# Altium project AMC_FMC_Carrier v3.PrjPcb (part 13 of 15)

## Sheet Clock_WR.SchDoc
size A3; DocumentNumber: 24; SheetNumber: 24; SheetTotal: 30
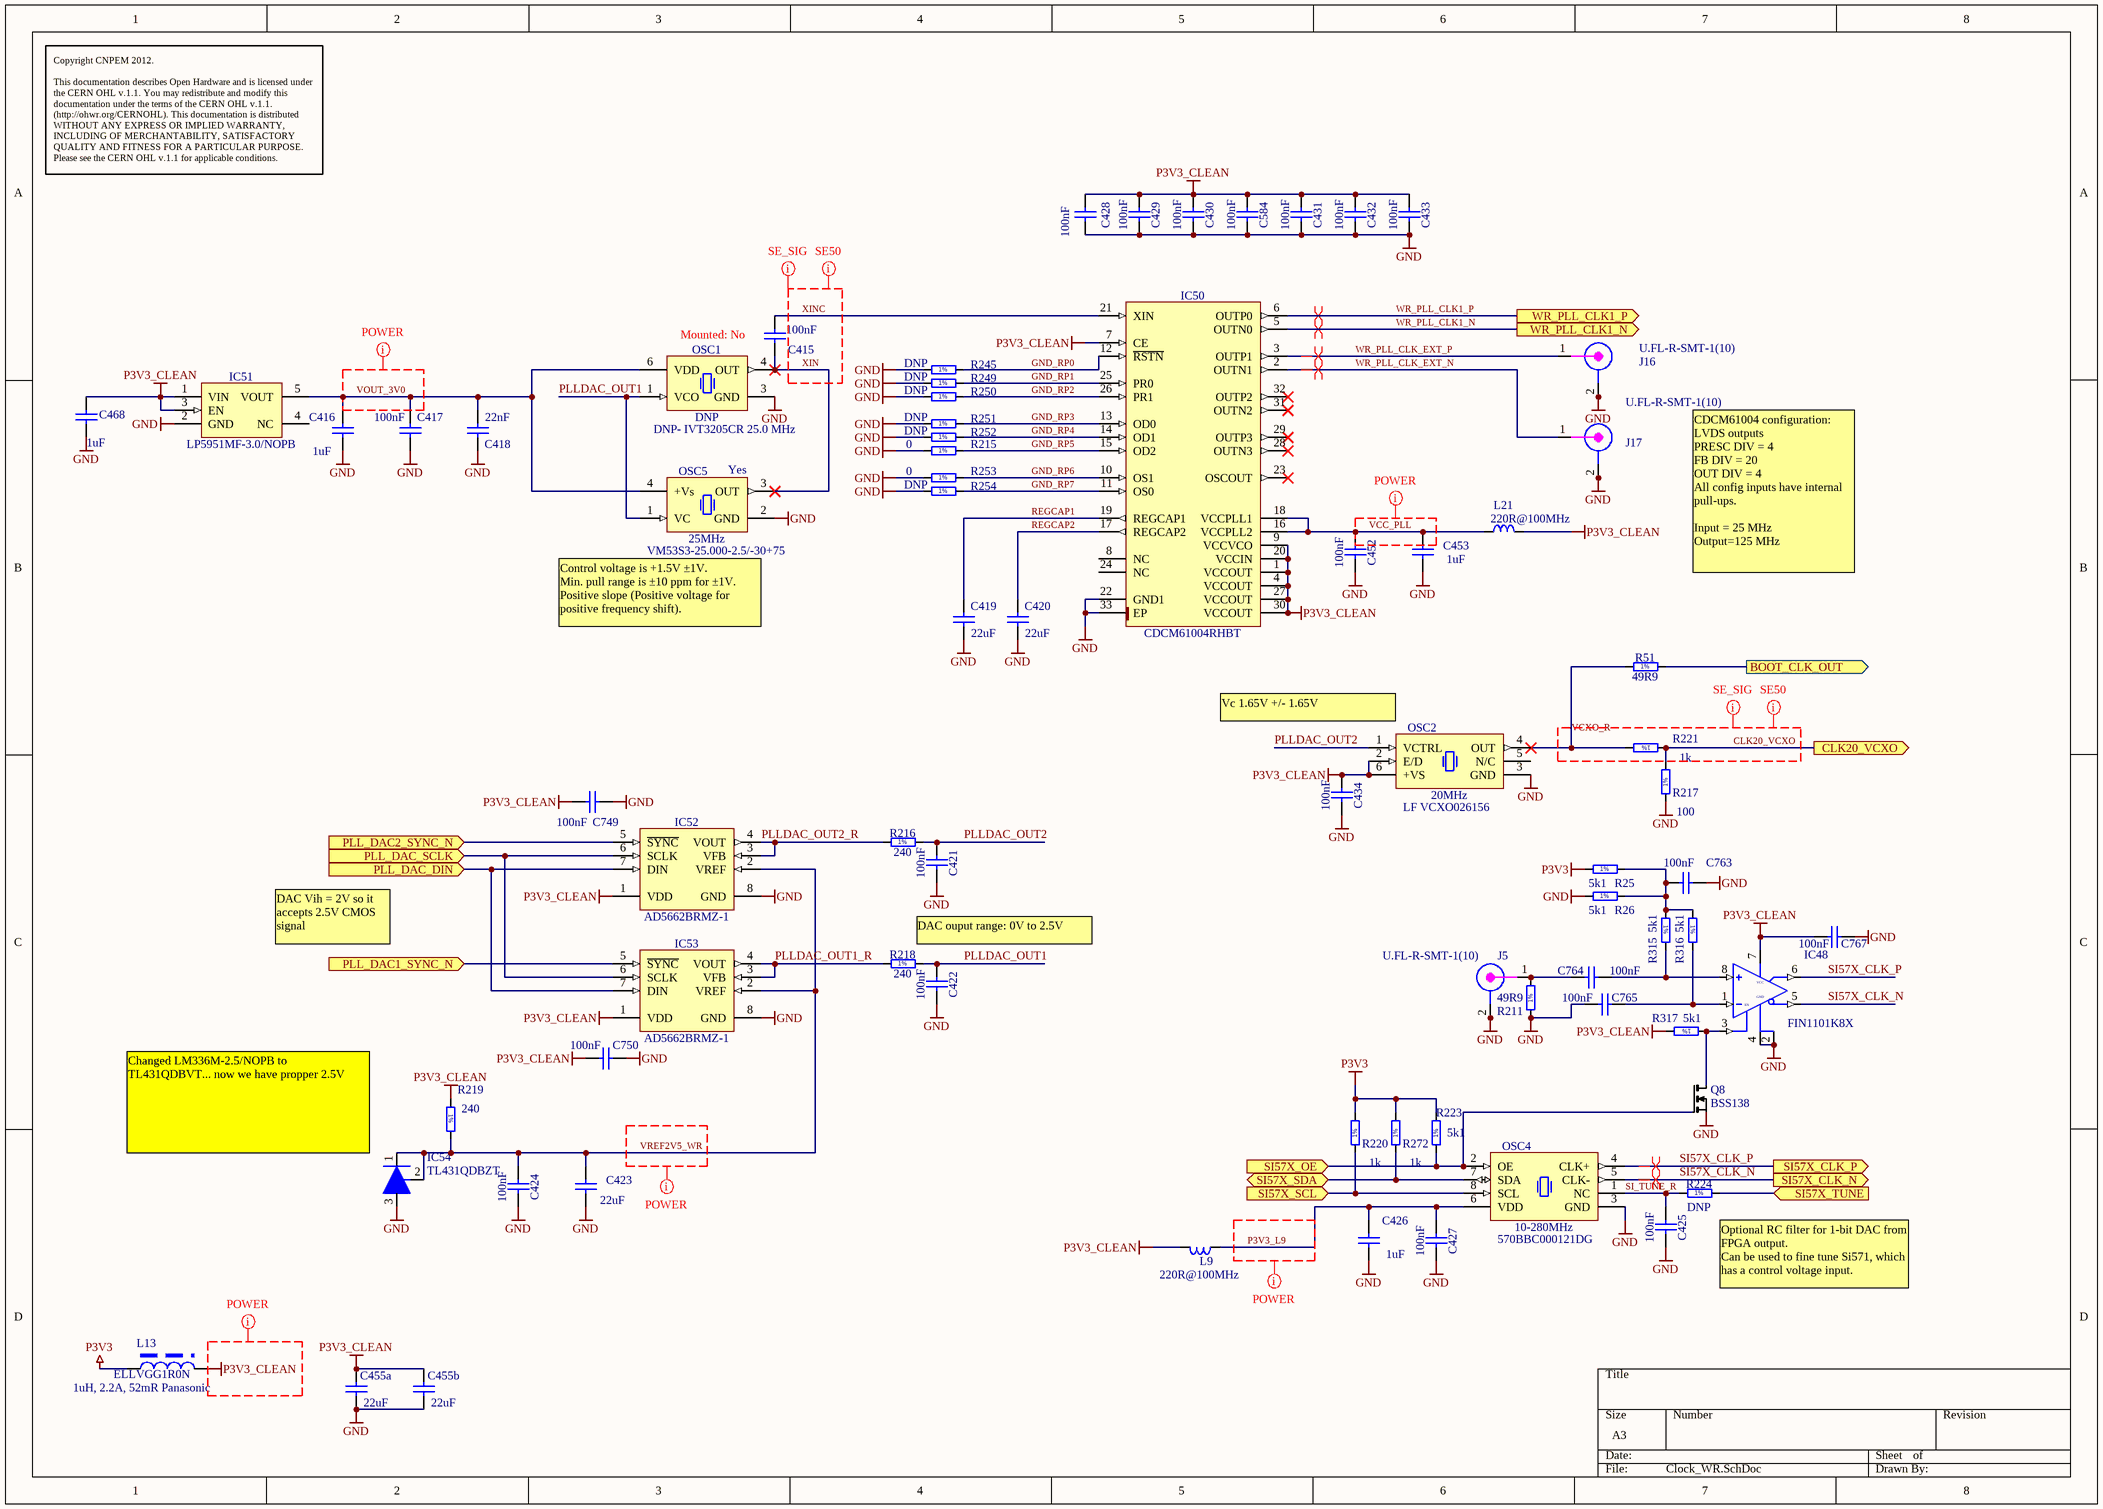
[diagram p29: Clock_WR.SchDoc]

### Parts
C415  100nF  [CAPC0603X33N]
C416  1uF  [CAPC1608X87N]
C417  100nF  [CAPC0603X33N]
C418  22nF  [CAPC0603X33N]
C419  22uF  [CAPC3216X180N]
C420  22uF  [CAPC3216X180N]
C421  100nF  [CAPC0603X33N]
C422  100nF  [CAPC0603X33N]
C423  22uF  [CAPC3216X180N]
C424  100nF  [CAPC0603X33N]
C425  100nF  [CAPC0603X33N]
C426  1uF  [CAPC1608X87N]
C427  100nF  [CAPC0603X33N]
C428  100nF  [CAPC0603X33N]
C429  100nF  [CAPC0603X33N]
C430  100nF  [CAPC0603X33N]
C431  100nF  [CAPC0603X33N]
C432  100nF  [CAPC0603X33N]
C433  100nF  [CAPC0603X33N]
C434  100nF  [CAPC0603X33N]
C452  100nF  [CAPC0603X33N]
C453  1uF  [CAPC1608X87N]
C455a  22uF  [CAPC3216X180N]
C455b  22uF  [CAPC3216X180N]
C468  1uF  [CAPC1608X87N]
C584  100nF  [CAPC0603X33N]
C749  100nF  [CAPC0603X33N]
C750  100nF  [CAPC0603X33N]
C763  100nF  [CAPC0603X33N]
C764  100nF  [CAPC0603X33N]
C765  100nF  [CAPC0603X33N]
C767  100nF  [CAPC0603X33N]
IC48  FIN1101K8X  [US8]
IC50  CDCM61004RHBT  [QFN50P500X500X100-33N-S355]
IC51  LP5951MF-3.0/NOPB  [SOT95P284X122-5N]
IC52  AD5662BRMZ-1  [SOP65P490X110-8N]
IC53  AD5662BRMZ-1  [SOP65P490X110-8N]
IC54  TL431QDBZT  [SOT-23]
J5  U.FL-R-SMT-1(10)  [CON_UFL_HIROSE_RECEPTACLE]
J16  U.FL-R-SMT-1(10)  [CON_UFL_HIROSE_RECEPTACLE]
J17  U.FL-R-SMT-1(10)  [CON_UFL_HIROSE_RECEPTACLE]
L9  220R@100MHz  [INDC2012X105N]
L13  ELLVGG1R0N  [L_ELLVGG2R2N]
L21  220R@100MHz  [INDC2012X105N]
OSC1  DNP  Manufacturer Part Number: DNP- IVT3205CR 25.0 MHz  Mounted: No  [OSC_RAKON_IVT3200C]
OSC2  20MHz  Manufacturer Part Number: LF VCXO026156  [OSC_IQD_CFPV-45]
OSC4  10-280MHz  Manufacturer Part Number: 570BBC000121DG  [OSC_SILICON-LAB_SI570]
OSC5  25MHz  Manufacturer Part Number: VM53S3-25.000-2.5/-30+75  Mounted: Yes  [OSCCC320X500X160-4N]
Q8  BSS138  [SOT95P251X112-3N]
R25  5k1  [RESC1608X55N]
R26  5k1  [RESC1608X55N]
R51  49R9  [RESC1005X40N]
R211  49R9  [RESC1005X40N]
R215  0  [RESC1005X40N]
R216  240  [RESC1005X40N]
R217  100  [RESC1005X40N]
R218  240  [RESC1005X40N]
R219  240  [RESC1005X40N]
R220  1k  [RESC1005X40N]
R221  1k  [RESC1005X40N]
R223  5k1  [RESC1608X55N]
R224  DNP  [RESC1005X40N]
R245  DNP  [RESC1005X40N]
R249  DNP  [RESC1005X40N]
R250  DNP  [RESC1005X40N]
R251  DNP  [RESC1005X40N]
R252  DNP  [RESC1005X40N]
R253  0  [RESC1005X40N]
R254  DNP  [RESC1005X40N]
R272  1k  [RESC1005X40N]
R315  5k1  [RESC1608X55N]
R316  5k1  [RESC1608X55N]
R317  5k1  [RESC1608X55N]

### Ports
BOOT_CLK_OUT (out), CLK20_VCXO (out), PLL_DAC1_SYNC_N (in), PLL_DAC2_SYNC_N (in), PLL_DAC_DIN (in), PLL_DAC_SCLK (in), SI57X_CLK_N (out), SI57X_CLK_P (out), SI57X_OE (in), SI57X_SCL (in), SI57X_SDA (bidir), SI57X_TUNE (in), WR_PLL_CLK1_N (out), WR_PLL_CLK1_P (out)

### Nets
GND: C416.1 C417.2 C418.1 C419.1 C420.1 C421.2 C422.2 C423.1 C424.2 C425.2 C426.1 C427.2 C428.1 C429.2 C430.2 C431.2 C432.2 C433.2 C434.2 C452.2 C453.1 C455a.1 C455b.1 C468.1 C584.2 C749.2 C750.2 C763.2 C765.1 C767.2 IC48.2(GND) IC48.4(GND) IC50.22(GND1) IC50.33(EP) IC51.2(GND) IC52.8(GND) IC53.8(GND) IC54.3(A) J5.2 J5.2a(GND) J16.2 J16.2a(GND) J17.2 J17.2a(GND) OSC1.3(GND) OSC2.3(GND) OSC4.3(GND) OSC5.2(GND) Q8.2(S) R26.1 R211.1 R215.1 R217.1 R245.1 R249.1 R250.1 R251.1 R252.1 R253.1 R254.1
P3V3: L13.1 R25.1 R220.2 R223.2 R272.2
P3V3_CLEAN: C428.2 C429.1 C430.1 C431.1 C432.1 C433.1 C434.1 C455a.2 C455b.2 C468.2 C584.1 C749.1 C750.1 C767.1 IC48.7(VCC) IC50.1(VCCOUT) IC50.4(VCCOUT) IC50.7(CE) IC50.9(VCCVCO) IC50.20(VCCIN) IC50.27(VCCOUT) IC50.30(VCCOUT) IC51.1(VIN) IC51.3(EN) IC52.1(VDD) IC53.1(VDD) L9.2 L13.2 L21.2 OSC2.2(E/D) OSC2.6(+VS) R219.1 R317.2
CLK20_VCXO: R217.2 R221.1 ; port CLK20_VCXO
FPGA_CLK.BOOT_CLK_IN: R51.2 ; port BOOT_CLK_OUT
GND_RP0: IC50.12(~{RSTN}) R245.2
GND_RP1: IC50.25(PR0) R249.2
GND_RP2: IC50.26(PR1) R250.2
GND_RP3: IC50.13(OD0) R251.2
GND_RP4: IC50.14(OD1) R252.2
GND_RP5: IC50.15(OD2) R215.2
GND_RP6: IC50.10(OS1) R253.2
GND_RP7: IC50.11(OS0) R254.2
I2C_Si57.SCL: OSC4.8(SCL) R220.1 ; port SI57X_SCL
I2C_Si57.SDA: OSC4.7(SDA) R272.1 ; port SI57X_SDA
P3V3_L9: C426.2 C427.1 L9.1 OSC4.6(VDD)
PLL_DAC1_SYNC_N: IC53.5(~{SYNC}) ; port PLL_DAC1_SYNC_N
PLL_DAC2_SYNC_N: IC52.5(~{SYNC}) ; port PLL_DAC2_SYNC_N
PLL_DAC_DIN: IC52.7(DIN) IC53.7(DIN) ; port PLL_DAC_DIN
PLL_DAC_SCLK: IC52.6(SCLK) IC53.6(SCLK) ; port PLL_DAC_SCLK
PLLDAC_OUT1: C422.1 OSC1.1(VCO) OSC5.1(VC) R218.2
PLLDAC_OUT1_R: IC53.3(VFB) IC53.4(VOUT) R218.1
PLLDAC_OUT2: C421.1 OSC2.1(VCTRL) R216.2
PLLDAC_OUT2_R: IC52.3(VFB) IC52.4(VOUT) R216.1
REGCAP1: C419.2 IC50.19(REGCAP1)
REGCAP2: C420.2 IC50.17(REGCAP2)
SI57X_CLK_N: IC48.5(~{Q}) OSC4.5(CLK-) ; port SI57X_CLK_N
SI57X_CLK_P: IC48.6(Q) OSC4.4(CLK+) ; port SI57X_CLK_P
SI57X_OE: OSC4.2(OE) Q8.1(G) R223.1 ; port SI57X_OE
SI57X_TUNE: R224.2 ; port SI57X_TUNE
SI_TUNE_R: C425.1 OSC4.1(NC) R224.1
VCC_PLL: C452.1 C453.2 IC50.16(VCCPLL2) IC50.18(VCCPLL1) L21.1
VCXO_R: OSC2.4(OUT) R51.1 R221.2
VOUT_3V0: C416.2 C417.1 C418.2 IC51.5(VOUT) OSC1.6(VDD) OSC5.4(+Vs)
VREF2V5_WR: C423.2 C424.1 IC52.2(VREF) IC53.2(VREF) IC54.1(I/O) IC54.2(REF) R219.2
WR_PLL_CLK1_N: IC50.5(OUTN0) ; port WR_PLL_CLK1_N
WR_PLL_CLK1_P: IC50.6(OUTP0) ; port WR_PLL_CLK1_P
WR_PLL_CLK_EXT_N: IC50.2(OUTN1) J17.1
WR_PLL_CLK_EXT_P: IC50.3(OUTP1) J16.1
XIN: C415.1 OSC1.4(OUT) OSC5.3(OUT)
XINC: C415.2 IC50.21(XIN)
NetC763_1: C763.1 R25.2 R26.2 R315.1 R316.1
NetC764_1: C764.1 IC48.8(IN) R315.2
NetC764_2: C764.2 J5.1 R211.2
NetC765_2: C765.2 IC48.1(IN) R316.2
NetIC48_3: IC48.3(EN) Q8.3(D) R317.1

Not connected (* = marked no-connect by the designer): IC50 8(NC) 23(OSCOUT)* 24(NC) 28(OUTN3)* 29(OUTP3)* 31(OUTN2)* 32(OUTP2)*; IC51 4(NC); OSC2 5(N/C)

### Layout directives
differential pair: SI57X_CLK_N, SI57X_CLK_P, WR_PLL_CLK1_N, WR_PLL_CLK1_P, WR_PLL_CLK_EXT_N, WR_PLL_CLK_EXT_P
net class DE_SIG: CLK20_VCXO, VCXO_R, XIN, XINC
net class SE50: CLK20_VCXO, VCXO_R, XIN, XINC
net class POWER: P3V3_CLEAN, P3V3_L9, VCC_PLL, VOUT_3V0, VREF2V5_WR

### Notes on the sheet
- Copyright CNPEM 2012.
  This documentation describes Open Hardware and is licensed under the CERN OHL v.1.1. You may redistribute and modify this documentation under the terms of the CERN OHL v.1.1. (http://ohwr.org/CERNOHL). This documentation is distributed WITHOUT ANY EXPRESS OR IMPLIED WARRANTY, INCLUDING OF MERCHANTABILITY, SATISFACTORY QUALITY AND FITNESS FOR A PARTICULAR PURPOSE. Please see the CERN OHL v.1.1 for applicable conditions.
- CDCM61004 configuration:
  LVDS outputs
  PRESC DIV = 4
  FB DIV = 20
  OUT DIV = 4
  All config inputs have internal pull-ups.
  Input = 25 MHz
  Output=125 MHz
- (near OSC5) Control voltage is +1.5V ±1V.
  Min. pull range is ±10 ppm for ±1V.
  Positive slope (Positive voltage for positive frequency shift).
- (near OSC2) Vc 1.65V +/- 1.65V
- DAC Vih = 2V so it accepts 2.5V CMOS signal
- DAC ouput range: 0V to 2.5V
- (near IC54) Changed LM336M-2.5/NOPB to TL431QDBVT... now we have propper 2.5V
- (near R224) Optional RC filter for 1-bit DAC from FPGA output.
  Can be used to fine tune Si571, which has a control voltage input.
- (in symbol L_CHOKE_ELLVGG) 1uH, 2.2A, 52mR Panasonic
- (in symbol R0402_0R_JUMPER) 1%
- (in symbol R0402_1K_1%_0.0625W_100PPM) 1%
- (in symbol R0402_49R9_1%_0.0625W_100PPM) 1%
- (in symbol R0402_100R_1%_0.0625W_100PPM) 1%
- (in symbol R0402_240R_1%_0.0625W_100PPM) 1%
- (in symbol R0603_5K1_1%_0.1W_100PPM) 1%

### Library data of the parts
C415 C417 C421 C422 C424 C425 C427-C434 C452 C584 C749 C750 C763-C765 C767 = CC0201_100NF_6.3V_10%_X5R: as C297 on sheet M-LVDS PHY; Part Number: CC0201_100NF_6.3V_10%_X5R; Component Kind: Standard; Component Type: Standard; Pin Count: 2; Value: 100nF; Status: Not Recommended; Manufacturer Part Number: CC0201_100NF_6.3V_10%_X5R; Case: 0201; Mounted: Yes; Socket: No; SMD: Yes; Manufacturer1 Example: AVX; Manufacturer1 ComponentHeight: 0.33mm; HelpURL: \\cern.ch\dfs\Applications\Altium\Datasheets\CC0201_X5R_AVX.pdf; Author: CERN DEM JLC; CreateDate: 2007-12-03; LatestRevisionDate: 2007-12-03
C416 C426 C468 = CC0603_1UF_16V_10%_X7R: Non-polarised capacitor; Part Description: SMD Multilayer Chip Ceramic Capacitor; Manufacturer: GENERIC; Manufacturer1 Part Number: 223824613663; Voltage: 16V; TC: X7R; Tolerance: ±10%; Table: Capacitors SMD; Part Number: CC0603_1UF_16V_10%_X7R; Component Kind: Standard; Component Type: Standard; Pin Count: 2; Value: 1uF; Status: Preferred; Manufacturer Part Number: CC0603_1uF_16V_10%_X7R; Case: 0603; Mounted: Yes; Socket: No; SMD: Yes; Manufacturer1 Example: PHYCOMP; Manufacturer1 ComponentHeight: 0.87mm; HelpURL: \\cern.ch\dfs\Applications\Altium\Datasheets\CC0805_X5R_PHYCOMP_HC.pdf; Author: CERN DEM JLC; CreateDate: 03/12/2007; LatestRevisionDate: 03/12/2007
C418 = CC0201_22NF_6.3V_10%_X5R: Non-polarised capacitor; Part Description: SMD Multilayer Chip Ceramic Capacitor; Manufacturer: GENERIC; Manufacturer1 Part Number: 02016D223KAT2A; Voltage: 6.3V; TC: X5R; Tolerance: ±10%; Table: Capacitors SMD; Part Number: CC0201_22NF_6.3V_10%_X5R; Component Kind: Standard; Component Type: Standard; Pin Count: 2; Value: 22nF; Status: Not Recommended; Manufacturer Part Number: CC0201_22NF_6.3V_10%_X5R; Case: 0201; Mounted: Yes; Socket: No; SMD: Yes; Manufacturer1 Example: AVX; Manufacturer1 ComponentHeight: 0.33mm; HelpURL: \\cern.ch\dfs\Applications\Altium\Datasheets\CC0201_X5R_AVX.pdf; Author: CERN DEM JLC; CreateDate: 2007-12-03; LatestRevisionDate: 2007-12-03
C419 C420 C423 C455a C455b = CC1206_22UF_10V_10%_X7R: as C454 on sheet Clock_management; Part Number: CC1206_22UF_10V_10%_X7R; Component Kind: Standard; Component Type: Standard; Pin Count: 2; Value: 22uF; Status: Preferred; Manufacturer Part Number: CC1206_22UF_10V_10%_X7R; Case: 1206; Mounted: Yes; Socket: No; SMD: Yes; Manufacturer1 Example: MURATA; Manufacturer1 ComponentHeight: 1.8mm; HelpURL: \\cern.ch\dfs\Applications\Altium\Datasheets\CC1206_X7R_MURATA_GRM-HI-CAP.pdf; Author: CERN DEM JLC; CreateDate: 2010-06-08; LatestRevisionDate: 2010-06-08
C453 = CC0603_1UF_16V_10%_X7R: Non-polarised capacitor; Part Description: SMD Multilayer Chip Ceramic Capacitor; Manufacturer: GENERIC; Manufacturer1 Part Number: 223824613663; Manufacturer1 Datasheet: \\cern.ch\dfs\Applications\Altium\Datasheets\CC0805_X5R_PHYCOMP_HC.pdf; Voltage: 16V; TC: X7R; Tolerance: ±10%; Table: Capacitors SMD; Part Number: CC0603_1UF_16V_10%_X7R; Component Kind: Standard; Component Type: Standard; Designator: Capacitor - non polarized; Library Reference: Capacitor - non polarized; Pin Count: 2; Value: 1uF; Status: Preferred; Manufacturer Part Number: CC0603_1uF_16V_10%_X7R; Case: 0603; Mounted: Yes; Socket: No; SMD: Yes; Manufacturer1 Example: PHYCOMP; Manufacturer1 ComponentHeight: 0.87mm; HelpURL: \\cern.ch\dfs\Applications\Altium\Datasheets\CC0805_X5R_PHYCOMP_HC.pdf; Author: CERN DEM JLC; CreateDate: 03/12/2007; LatestRevisionDate: 03/12/2007
IC48 = IFC_FIN1101K8X: LVDS TO LVDS repeater3.3V
IC50 = CDCM61004RHBT: Four Output, Integrated VCO, Low-Jitter Clock Generator; Manufacturer: TEXAS INSTRUMENTS; Table: Analog & Interface; Part Number: CDCM61004RHBT; Component Kind: Standard; Component Type: Standard; Device: CDCM61004RHBT; PackageDescription: QFN, (MO-220-VHHD-4) 0.50mm pitch,square; 8 pin X 8 pin, 5mm X 5mm X 1.00mm H body (w/thermal tab 3.5 X 3.5mm),  IPC Medium Density; Part Description: Four Output, Integrated VCO, Low-Jitter Clock Generator; Manufacturer Part Number: CDCM61004RHBT; Pin Count: 33; Case: QFN32; Mounted: Yes; Socket: No; SMD: Yes; ComponentHeight: 1mm; Author: CERN DEM JLC; HelpURL: \\cern.ch\dfs\Applications\Altium\Datasheets\CDCM61004RHBT.pdf; CreateDate: 2010-08-25; LatestRevisionDate: 2010-08-25
IC51 = LP5951MF-3.0/NOPB: 150mA Micropower Low-Dropout CMOS Voltage Regulator; Part Description: 3V,  150mA Micropower Low-Dropout CMOS Voltage Regulator; Manufacturer: NATIONAL SEMICONDUCTOR; Table: Regulators; Part Number: LP5951MF-3.0/NOPB; Component Kind: Standard; Component Type: Standard; Device: LP5951MF-3.0/NOPB; PackageDescription: SOT23 5, Pitch 0.95mm - Body 1.67x2.99mm, IPC Medium Density; Manufacturer Part Number: LP5951MF-3.0/NOPB; Pin Count: 5; Case: SOT23-5; Mounted: Yes; Socket: No; SMD: Yes; ComponentHeight: 1.19mm; HelpURL: \\cern.ch\dfs\Applications\Altium\Datasheets\LP5951MF-3.0-NOPB.pdf; Author: CERN DEM JLC; CreateDate: 24/01/2011; LatestRevisionDate: 24/01/2011
IC52 IC53 = AD5662BRMZ-1: 2.7V to 5.5V, 250uA, Rail-to-Rail Output 16-Bit nanoDAC; Manufacturer: ANALOG DEVICES; Table: Analog & Interface; Part Number: AD5662BRMZ-1; Component Kind: Standard; Component Type: Standard; Device: AD5662BRMZ-1; PackageDescription: SOP, 8-Leads, Body 3.0x3.0mm, Pitch 0.65mm, IPC Medium Density; Part Description: 2.7V to 5.5V, 250uA, Rail-to-Rail Output 16-Bit nanoDAC; Manufacturer Part Number: AD5662BRMZ-1; Pin Count: 8; Case: MSOP8; Mounted: Yes; Socket: No; SMD: Yes; ComponentHeight: 1.1mm; Author: CERN DEM JLC; HelpURL: \\cern.ch\dfs\Applications\Altium\Datasheets\AD5662BRMZ-1.pdf; CreateDate: 1/10/2011; LatestRevisionDate: 1/10/2011
IC54 = REF_TL431_SOT23: 2.5V ADJ Voltage reference
J5 J16 J17 = CON_UFL_SMD: UFL; Supplier 1: Newark; Supplier Part Number 1: 50P8856
L9 L21 = IND0805_MURATA_BLM21PG221SN1D: Inductor; Part Description: SMD EMIFIL Suppression Chip Bead Ferrite; Manufacturer: MURATA; Power: 2A; Resistance: 0.05R; Tolerance: ±25%; Table: Inductors SMD; Part Number: IND0805_MURATA_BLM21PG221SN1D; Component Kind: Standard; Component Type: Standard; Pin Count: 2; Value: 220R@100MHz; Status: None; Manufacturer Part Number: BLM21PG221SN1D; Case: 0805; Mounted: Yes; Socket: No; SMD: Yes; ComponentHeight: 1.05mm; HelpURL: \\cern.ch\dfs\Applications\Altium\Datasheets\IND0402_MURATA_BLM21P.pdf; Author: CERN DEM JLC; CreateDate: 25/01/2010; LatestRevisionDate: 25/01/2010
L13 = L_CHOKE_ELLVGG: 2.2uH, 1.4A, 92mR Panasonic
OSC1 = OSC_25MHZ_RAKON_IVT3205CR: Oscillator 4 pins 1=VCO 3=GND 4=OUT 6=VDC; Part Description: 11pF 3.3V ±1ppm Surface Mount TCXO Voltage Controlled Oscillator (IT3200C Serie); Manufacturer: RAKON; Value: 25MHz; Table: Crystals & Oscillators; Part Number: OSC_25MHZ_RAKON_IVT3205CR; Component Kind: Standard; Component Type: Standard; PackageDescription: Oscillator IVT3200C Serie, corner concave; 4 pin, 2.50mm L X 3.2mm W X 1.1mm H; Pin Count: 4; Socket: No; SMD: Yes; ComponentHeight: 1.1mm; HelpURL: \\cern.ch\dfs\Applications\Altium\Datasheets\OSC_RAKON_IVT3200C.pdf; Author: CERN DEM JLC; CreateDate: 08/02/2010; LatestRevisionDate: 08/02/2010
OSC2 = OSC_20MHZ_IQD_LF VCXO026156: 3.3V ±100ppm 15pF HCMOS Tri-State Surface Mount Voltage Controlled Oscillator VCXO (CFPV-45 Serie); Manufacturer: IQD FREQUENCY PRODUCTS; Table: Crystals & Oscillators; Part Number: OSC_20MHZ_IQD_LF VCXO026156; Component Kind: Standard; Component Type: Standard; PackageDescription: SMD VCXO, side convave, 6 pins, 5.00x7.00mm (CFPV-45 Serie); Value: 20MHz; Part Description: 3.3V ±100ppm 15pF HCMOS Tri-State Surface Mount Voltage Controlled Oscillator VCXO (CFPV-45 Serie); Pin Count: 6; Mounted: Yes; Socket: No; SMD: Yes; ComponentHeight: 1.7mm; HelpURL: \\cern.ch\dfs\Applications\Altium\Datasheets\OSC_IQD_CFPV-45.pdf; Author: CERN DEM JLC; CreateDate: 1/24/2011; LatestRevisionDate: 1/24/2011
OSC4 = OSC_10-280MHZ_SILICON-LAB_Si570BBC000121DG: Any-Rate I2C Programmable XO Oscillator Si570 Serie; Part Description: 10-280MHz 3.3V ±20ppm LVDS Any-Rate I2C Programmable XO Oscillator Si570 Serie; Manufacturer: SILICON LABS; Table: Crystals & Oscillators; Part Number: OSC_10-280MHZ_SILICON-LAB_Si570BBC000121DG; Component Kind: Standard; Component Type: Standard; PackageDescription: Oscillator Si570 Serie, 8 pins, 5x7mm; Value: 10-280MHz; Pin Count: 8; Mounted: Yes; Socket: No; SMD: Yes; ComponentHeight: 1.85mm; HelpURL: \\cern.ch\dfs\Applications\Altium\Datasheets\OSC_SILICON-LAB_SI570.pdf; Author: CERN DEM JLC; CreateDate: 2/9/2010; LatestRevisionDate: 2/9/2010
OSC5 = OSC_25MHZ_MERCURY_VM53S3-25.000-2.5/-30+75: Oscillator 4 pins 1=VC 2=GND 3=OUT 4=+Vs; Part Description: 3V ±2.5ppmVoltage Controlled Temperature Compensated Crystal Oscillator VM53S3 Serie; Manufacturer: MERCURY ELECTRONICS; Table: Crystals & Oscillators; Part Number: OSC_25MHZ_MERCURY_VM53S3-25.000-2.5/-30+75; Component Kind: Standard; Component Type: Standard; PackageDescription: SMD Oscillator, Corner Convave, 4 pins, 5x3.2mm; Value: 25MHz; Pin Count: 4; Socket: No; SMD: Yes; ComponentHeight: 1.6mm; HelpURL: \\cern.ch\dfs\Applications\Altium\Datasheets\OSC_MERCURY_VM53S3.pdf; Author: CERN DEM JLC; CreateDate: 1/20/2010; LatestRevisionDate: 1/24/2011
Q8 = Q_BSS138
R25 R26 R223 R315-R317 = R0603_5K1_1%_0.1W_100PPM: Resistor - 1%; Part Description: General Purpose Thick Film Chip Resistor; Manufacturer: GENERIC; Manufacturer1 Part Number: NRC06F5101TRF; Power: 0.1W; TC: ±100ppm/°C; Table: Resistors SMD; Part Number: R0603_5K1_1%_0.1W_100PPM; Component Kind: Standard; Component Type: Standard; Pin Count: 2; Value: 5k1; Status: Preferred; Tolerance: ±1%; Manufacturer Part Number: R0603_5K1_1%_0.1W_100PPM; Case: 0603; Mounted: Yes; Socket: No; SMD: Yes; Manufacturer1 Example: NIC COMPONENT; Manufacturer1 ComponentHeight: 0.55mm; HelpURL: \\cern.ch\dfs\Applications\Altium\Datasheets\R0603_NIC_NRC.pdf; Author: CERN DEM JLC; CreateDate: 03/12/2007; LatestRevisionDate: 13/03/2008
R51 R211 = R0402_49R9_1%_0.0625W_100PPM: Resistor - 1%; Part Description: General Purpose Thick Film Chip Resistor; Manufacturer: GENERIC; Manufacturer1 Part Number: 232270674999L or RC0402FR-0749R9L; TC: ±100ppm/°C; Table: Resistors SMD; Part Number: R0402_49R9_1%_0.0625W_100PPM; Component Kind: Standard; Component Type: Standard; Pin Count: 2; Value: 49R9; Status: Not recommended; Power: 0.0625W; Tolerance: ±1%; Manufacturer Part Number: R0402_49R9_1%_0.0625W_100PPM; Case: 0402; Mounted: Yes; Socket: No; SMD: Yes; Manufacturer1 Example: YAGEO PHYCOMP; Manufacturer1 ComponentHeight: 0.4mm; HelpURL: \\cern.ch\dfs\Applications\Altium\Datasheets\R0402_Phycomp_RC0402.pdf; Author: CERN DEM JLC; CreateDate: 2012-10-24; LatestRevisionDate: 2012-10-24
R215 R253 = R0402_0R_JUMPER: as R136 on sheet Clock_management; Part Number: R0402_0R_JUMPER; Component Kind: Standard; Component Type: Standard; Pin Count: 2; Value: 0; Status: Not recommended; Manufacturer Part Number: R0402_0R_JUMPER; Case: 0402; Socket: No; SMD: Yes; Manufacturer1 Example: YAGEO PHYCOMP; Manufacturer1 ComponentHeight: 0.4mm; HelpURL: \\cern.ch\dfs\Applications\Altium\Datasheets\R0402_Phycomp_RC0402.pdf; Author: CERN DEM JLC; CreateDate: 2007-12-03; LatestRevisionDate: 2012-10-17; Mounted: Yes
R216 R218 R219 = R0402_240R_1%_0.0625W_100PPM: Resistor - 1%; Part Description: General Purpose Thick Film Chip Resistor; Manufacturer: GENERIC; Manufacturer1 Part Number: 232270672401L; TC: ±100ppm/°C; Table: Resistors SMD; Part Number: R0402_240R_1%_0.0625W_100PPM; Component Kind: Standard; Component Type: Standard; Pin Count: 2; Value: 240; Status: Not recommended; Power: 0.0625W; Tolerance: ±1%; Manufacturer Part Number: R0402_240R_1%_0.0625W_100PPM; Case: 0402; Mounted: Yes; Socket: No; SMD: Yes; Manufacturer1 Example: YAGEO PHYCOMP; Manufacturer1 ComponentHeight: 0.4mm; HelpURL: \\cern.ch\dfs\Applications\Altium\Datasheets\R0402_Phycomp_RC0402.pdf; Author: CERN DEM JLC; CreateDate: 2007-12-03; LatestRevisionDate: 2012-10-17
R217 = R0402_100R_1%_0.0625W_100PPM: Resistor - 1%; Part Description: General Purpose Thick Film Chip Resistor; Manufacturer: GENERIC; Manufacturer1 Part Number: 232270671001L; TC: ±100ppm/°C; Table: Resistors SMD; Part Number: R0402_100R_1%_0.0625W_100PPM; Component Kind: Standard; Component Type: Standard; Pin Count: 2; Value: 100; Status: Not recommended; Power: 0.0625W; Tolerance: ±1%; Manufacturer Part Number: R0402_100R_1%_0.0625W_100PPM; Case: 0402; Mounted: Yes; Socket: No; SMD: Yes; Manufacturer1 Example: YAGEO PHYCOMP; Manufacturer1 ComponentHeight: 0.4mm; HelpURL: \\cern.ch\dfs\Applications\Altium\Datasheets\R0402_Phycomp_RC0402.pdf; Author: CERN DEM JLC; CreateDate: 2007-12-03; LatestRevisionDate: 2012-10-17
R220 R221 R272 = R0402_1K_1%_0.0625W_100PPM: Resistor - 1%; Part Description: General Purpose Thick Film Chip Resistor; Manufacturer: GENERIC; Manufacturer1 Part Number: 232270671002L; TC: ±100ppm/°C; Table: Resistors SMD; Part Number: R0402_1K_1%_0.0625W_100PPM; Component Kind: Standard; Component Type: Standard; Pin Count: 2; Value: 1k; Status: Not recommended; Power: 0.0625W; Tolerance: ±1%; Manufacturer Part Number: R0402_1K_1%_0.0625W_100PPM; Case: 0402; Mounted: Yes; Socket: No; SMD: Yes; Manufacturer1 Example: YAGEO PHYCOMP; Manufacturer1 ComponentHeight: 0.4mm; HelpURL: \\cern.ch\dfs\Applications\Altium\Datasheets\R0402_Phycomp_RC0402.pdf; Author: CERN DEM JLC; CreateDate: 2007-12-03; LatestRevisionDate: 2012-10-17
R224 = R0402_100R_1%_0.0625W_100PPM: Resistor - 1%; Part Description: General Purpose Thick Film Chip Resistor; Manufacturer: GENERIC; Manufacturer1 Part Number: 232270671001L; Value: 100; TC: ±100ppm/°C; Table: Resistors SMD; Part Number: R0402_100R_1%_0.0625W_100PPM; Component Kind: Standard; Component Type: Standard; Pin Count: 2; Status: Not recommended; Power: 0.0625W; Tolerance: ±1%; Manufacturer Part Number: R0402_100R_1%_0.0625W_100PPM; Case: 0402; Mounted: Yes; Socket: No; SMD: Yes; Manufacturer1 Example: YAGEO PHYCOMP; Manufacturer1 ComponentHeight: 0.4mm; HelpURL: \\cern.ch\dfs\Applications\Altium\Datasheets\R0402_Phycomp_RC0402.pdf; Author: CERN DEM JLC; CreateDate: 2007-12-03; LatestRevisionDate: 2012-10-17
R245 R249-R252 R254 = R0402_0R_JUMPER: as R67 on sheet Clock_management; Part Number: R0402_0R_JUMPER; Component Kind: Standard; Component Type: Standard; Pin Count: 2; Status: Not recommended; Manufacturer Part Number: R0402_0R_JUMPER; Case: 0402; Socket: No; SMD: Yes; Manufacturer1 Example: YAGEO PHYCOMP; Manufacturer1 ComponentHeight: 0.4mm; HelpURL: \\cern.ch\dfs\Applications\Altium\Datasheets\R0402_Phycomp_RC0402.pdf; Author: CERN DEM JLC; CreateDate: 2007-12-03; LatestRevisionDate: 2012-10-17; Mounted: Yes